# EAGLE schematic VenusGPS (EAGLE 6.1)
DATABASE: ./../PARTSDB.TXT
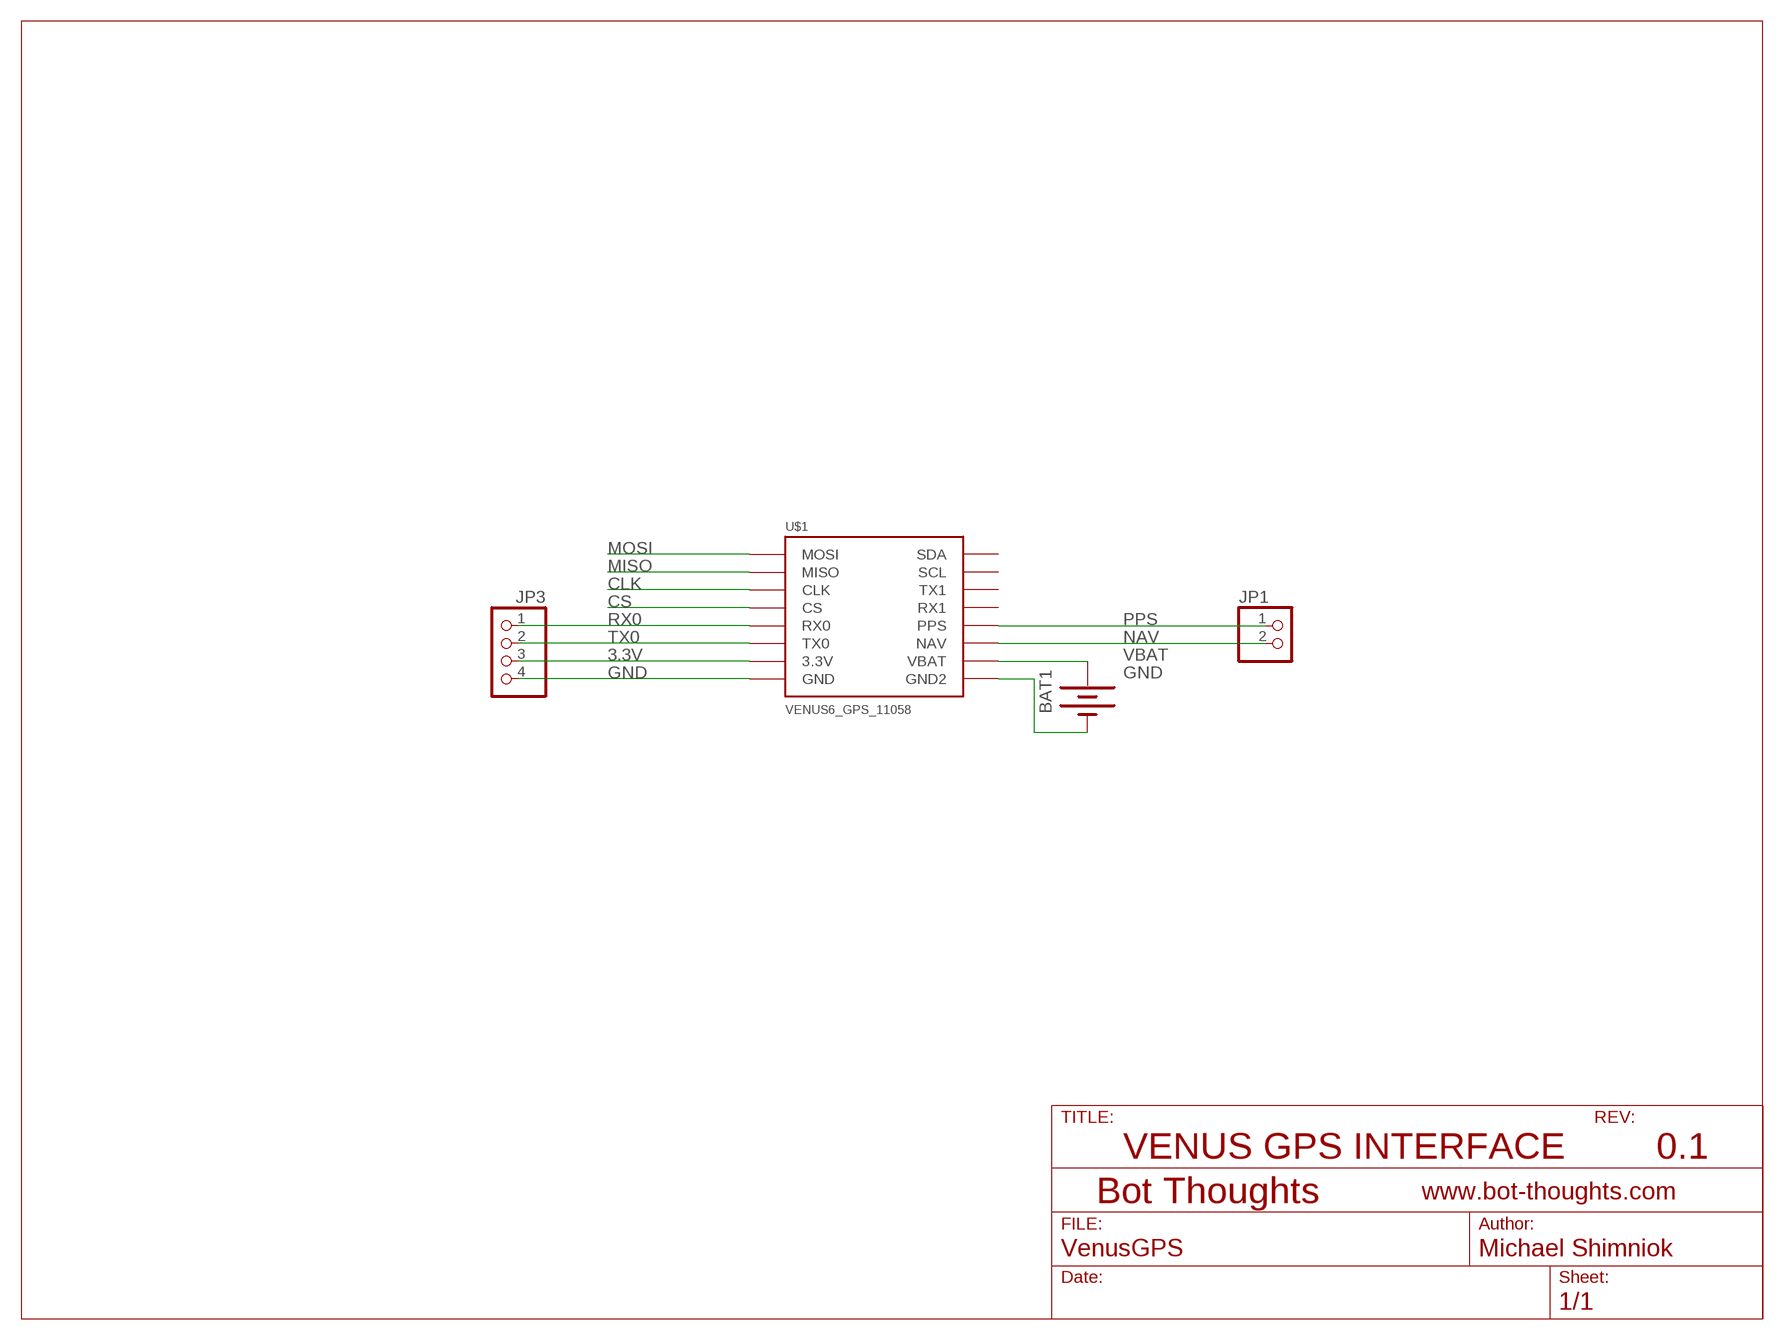
[diagram p0: schematic, sheet 1]

## Parts
BAT1  BATTERY12MM  [BATTCON_12MM]
JP1  PINHD-1X02_2.54  [1X02]
JP3  PINHD-1X04_2.54  [1X04]
U$1  VENUS6_GPS_11058  [VENUS6]

## Nets
3.3V: JP3.3 U$1.P7(3.3V)
CLK: U$1.P3(CLK)
CS: U$1.P4(CS)
GND: BAT1.GND(-) JP3.4 U$1.P8(GND) U$1.P9(GND2)
MISO: U$1.P2(MISO)
MOSI: U$1.P1(MOSI)
NAV: JP1.2 U$1.P11(NAV)
PPS: JP1.1 U$1.P12(PPS)
RX0: JP3.1 U$1.P5(RX0)
TX0: JP3.2 U$1.P6(TX0)
VBAT: BAT1.PWR@1(+) U$1.P10(VBAT)
Unconnected: U$1.P13(RX1) U$1.P14(TX1) U$1.P15(SCL) U$1.P16(SDA)

## Notes on the sheet
- VENUS GPS INTERFACE | 0.1

## Library data of the parts
BAT1 = SparkFun:BATTERY: Battery Holders Various common sizes : AA, AAA, 20mm coin cell and 12mm coin cell.; BOM: INCLUDE; PARTNO: 3000
JP1 = pinhead-2:PINHD-1X02: PIN HEADER; BOM: EXCLUDE
JP3 = pinhead-2:PINHD-1X04: PIN HEADER; BOM: EXCLUDE
U$1 = mes:VENUS6_GPS_11058: Venus GPS with SMA Connector Sparkfun sku: GPS-11058 <http://www.sparkfun.com/products/11058> Latest version of our Venus GPS board; the smallest, most powerful, and most versatile GPS receiver we carry. It's based on the Venus638FLPx, the successor to the Venus634LPx. The Venus638FLPx outputs standard NMEA-0183 or SkyTraq Binary sentences at a default rate of 9600bps (adjustable to 115200bps), with update rates up to 20Hz! The Venus638FLPx also allows for limited on-chip logging (check out the firmware below), as well as external logging using a SPI flash memory chip (not included).; BOM: EXCLUDE